# EAGLE design ads8330 (EAGLE 7.6.0)
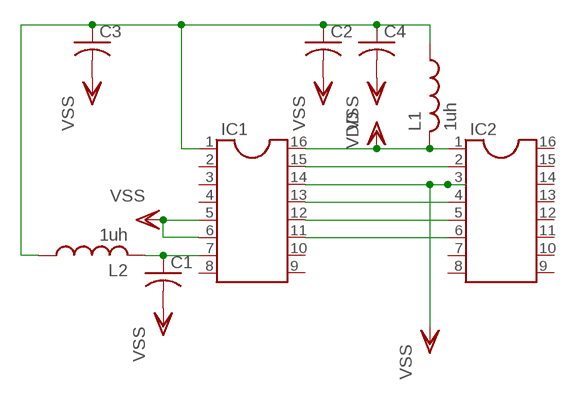
[diagram p0: schematic, sheet 1]

## Parts
C1  C-US025-025X050  [C025-025X050]
C2  C-US025-025X050  [C025-025X050]
C3  C-US025-025X050  [C025-025X050]
C4  C-US025-025X050  [C025-025X050]
IC1  DIL16S  [SOCKET-16]
IC2  DIL16S  [SOCKET-16]
L1  1uh  L-US0204/7  [0204/7]
L2  1uh  L-US0204/7  [0204/7]

## Nets
N$2: IC1.15 IC2.2
N$4: IC1.13 IC2.4
N$5: IC1.12 IC2.5
N$6: IC1.11 IC2.6
N$8: C1.1 IC1.7 L2.2
N$10: C2.1 C3.1 C4.1 IC1.1 L1.1 L2.1
VDD: IC1.16 IC2.1 L1.2
VSS: C1.2 C2.2 C3.2 C4.2 IC1.5 IC1.6 IC1.14 IC2.3
Unconnected: IC1.2 IC1.3 IC1.4 IC1.8 IC1.9 IC1.10 IC2.7 IC2.8 IC2.9 IC2.10 IC2.11 IC2.12 IC2.13 IC2.14 IC2.15 IC2.16

## Library data of the parts
C1-C4 = resistor:C-US: CAPACITOR, American symbol
IC1 IC2 = ic-package:DIL16: Dual In Line / Socket
L1 L2 = resistor:L-US: INDUCTOR, American symbol

## Board
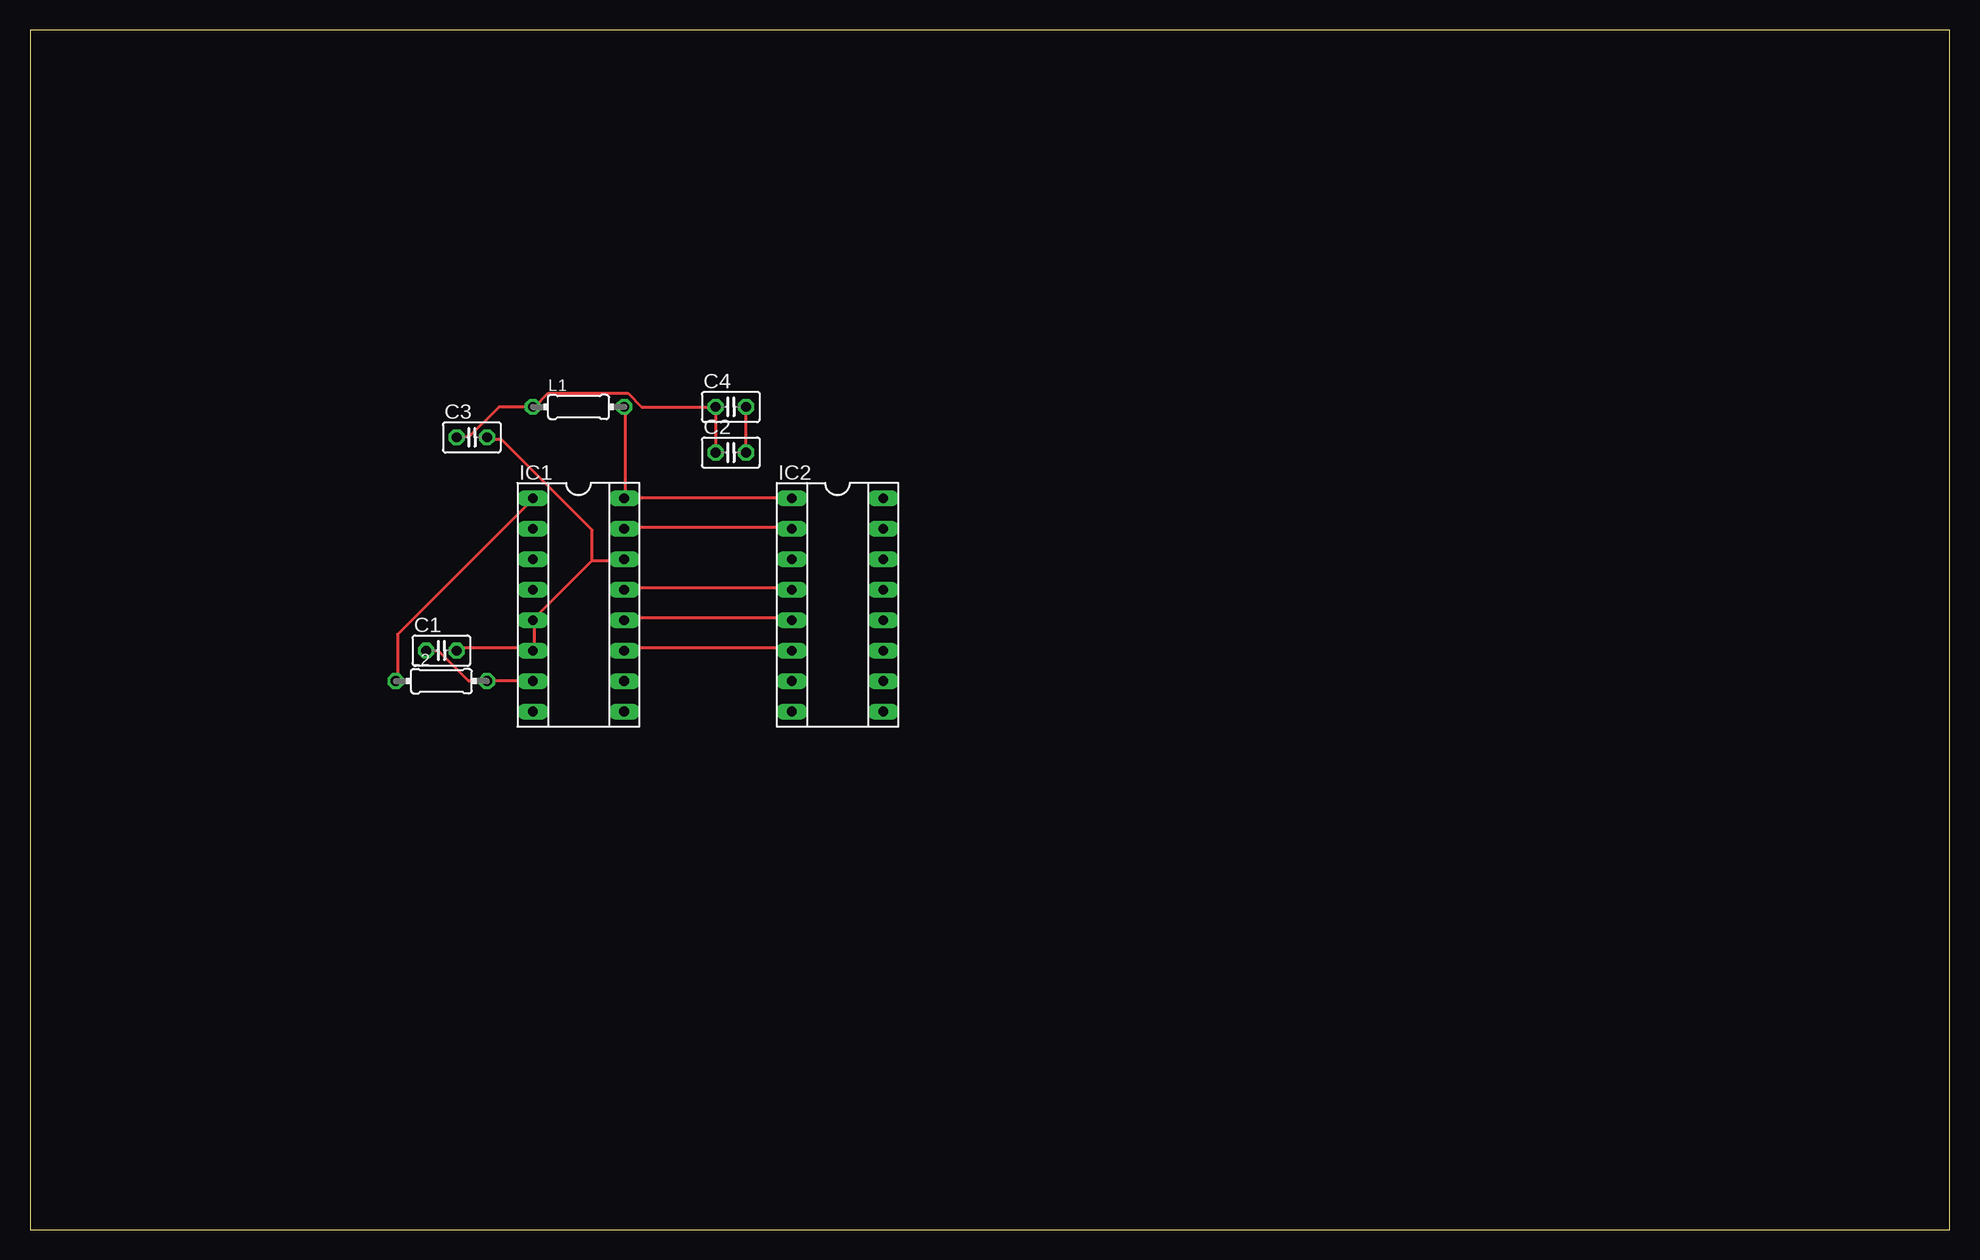
[diagram p1: board, top side]
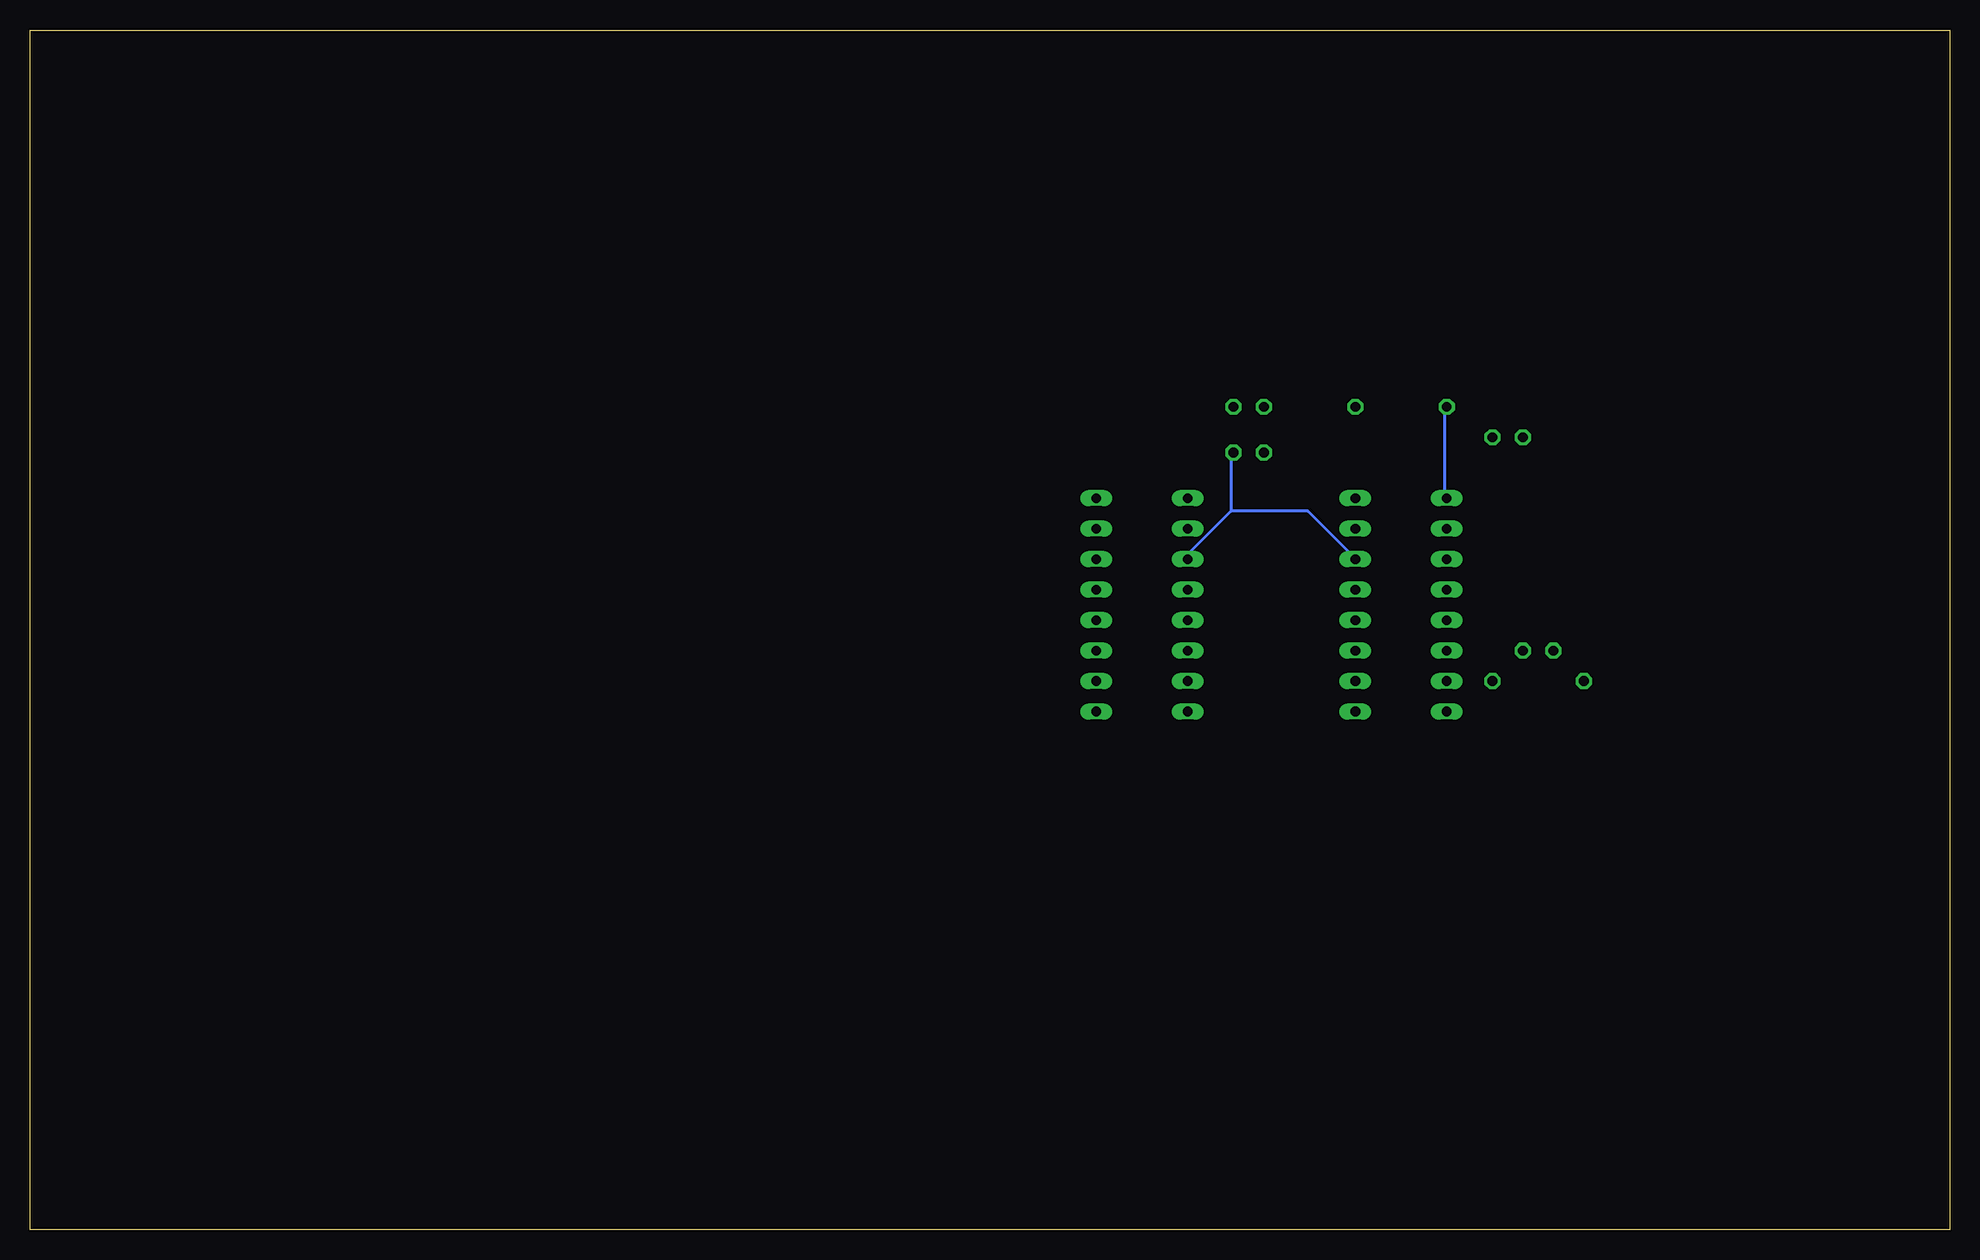
[diagram p2: board, bottom side, seen from below]

Size 160 x 100 mm. Coordinates in mm from the lower left corner, seen from the top.
Outline: 0,0 160,0 160,100 0,100 0,0
Copper layers (1*16): Top 0.035mm / dielectric 1.5mm / Bottom 0.035mm
Design rules "default": minimum track width 10mil, minimum drill 24mil, track to track 8mil, track to pad 8mil, pad to pad 8mil, via to via 8mil, smd to smd 8mil, copper to edge 40mil, drill to drill 8mil, minimum pad ring 10mil, minimum via ring 8mil, stop-mask expansion 4mil, vias tented up to drill 0mil, thermal gap 10mil

### Footprints (pad centres in the part's own frame; a part is rotated, then mirrored left to right if it is on the bottom)
C025-025X050 = drill 0.813 octagon: 1 -1.27,0; 2 1.27,0
SOCKET-16 = drill 0.813 long: 1 -8.89,-3.81; 2 -6.35,-3.81; 3 -3.81,-3.81; 4 -1.27,-3.81; 5 1.27,-3.81; 6 3.81,-3.81; 7 6.35,-3.81; 8 8.89,-3.81; 9 8.89,3.81; 10 6.35,3.81; 11 3.81,3.81; 12 1.27,3.81; 13 -1.27,3.81; 14 -3.81,3.81; 15 -6.35,3.81; 16 -8.89,3.81
0204/7 = drill 0.813 octagon: 1 -3.81,0; 2 3.81,0

### Placement (x,y rotation side)
C1  34.29,48.26 0 top
C2  58.42,64.77 0 top
C3  36.83,66.04 0 top
C4  58.42,68.58 0 top
IC1  45.72,52.07 270 top
IC2  67.31,52.07 270 top
L1  45.72,68.58 0 top
L2  34.29,45.72 0 top

### Tracks (layer width: path | path; a pad name or v marks a point on that pad's centre or on a via)
N$2
  Top 0.254: IC1.15 49.61,58.52 63.32,58.52 IC2.2
N$4
  Top 0.254: IC1.13 49.61,53.49 63.32,53.49 IC2.4
N$5
  Top 0.254: IC1.12 49.61,50.98 63.32,50.98 IC2.5
N$6
  Top 0.254: IC1.11 49.61,48.46 63.32,48.46 IC2.6
N$8
  Top 0.254: IC1.7 L2.2 36.58,45.72 34.06,48.23 33.15,48.23 C1.1
N$10
  Top 0.254: C2.1 C4.1 50.98,68.58 49.84,69.72 43.2,69.72 42.06,68.58 L1.1 39.09,68.58 36.58,66.06 35.66,66.06 C3.1 | L2.1 30.63,45.72 30.63,49.61 41.83,60.81 IC1.1
  Bottom 0.254: L1.1 42.06,68.58 42.06,61.04 IC1.1
VDD
  Top 0.254: 49.61,61.04 49.61,68.58 L1.2 | 49.61,61.04 63.32,61.04 IC2.1 | 49.61,61.04 IC1.16
VSS
  Top 0.254: C2.2 59.66,64.92 59.66,68.58 C4.2 | C1.2 35.66,48.46 41.83,48.46 IC1.6 42.06,48.46 42.06,50.75 IC1.5 42.06,50.98 46.86,55.78 | 46.86,55.78 49.38,55.78 IC1.14 | 46.86,55.78 46.86,58.29 39.32,65.84 38.18,65.84 C3.2
  Bottom 0.254: 59.89,59.89 63.32,56.46 63.32,56.01 IC2.3 | 59.89,59.89 59.89,64.69 C2.2 | 59.89,59.89 53.49,59.89 49.61,56.01 IC1.14